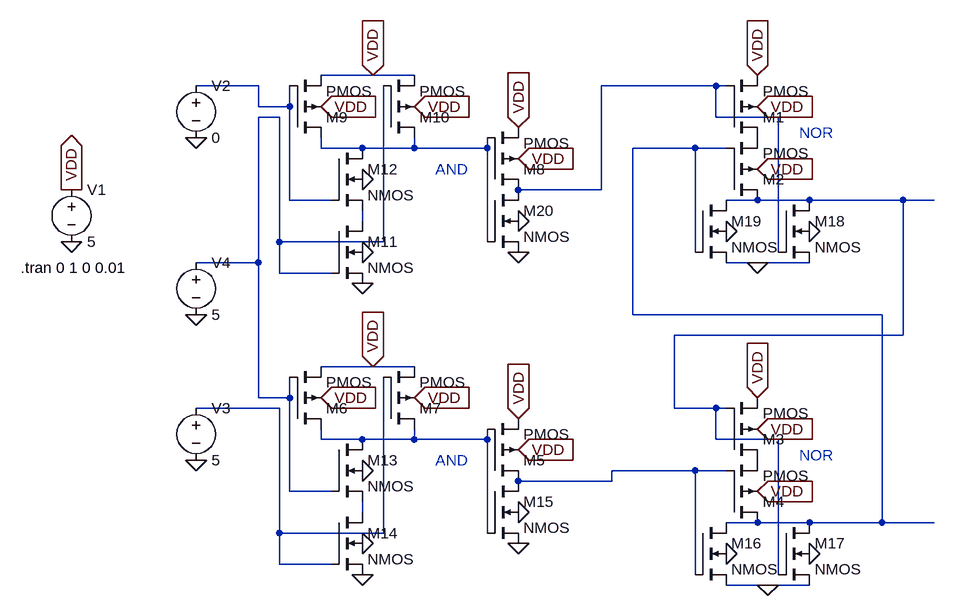
[diagram p0: schematic Gated_SR_Latch.asc]
Gated_SR_Latch.asc, the LTspice schematic file:
Version 4
SHEET 1 1076 820
WIRE 208 16 128 16
WIRE 272 16 208 16
WIRE 32 32 -64 32
WIRE 736 32 560 32
WIRE 752 32 736 32
WIRE 32 64 32 32
WIRE 80 64 80 32
WIRE 80 64 32 64
WIRE 64 80 32 80
WIRE 736 80 736 32
WIRE 832 80 736 80
WIRE 128 128 128 112
WIRE 192 128 128 128
WIRE 272 128 272 112
WIRE 272 128 192 128
WIRE 384 128 384 112
WIRE 384 128 272 128
WIRE 704 128 608 128
WIRE 752 128 704 128
WIRE 560 192 560 32
WIRE 560 192 432 192
WIRE 80 208 80 64
WIRE 144 208 80 208
WIRE 800 208 752 208
WIRE 880 208 800 208
WIRE 1024 208 880 208
WIRE 1072 208 1024 208
WIRE 192 240 192 224
WIRE 64 272 64 80
WIRE 224 272 224 32
WIRE 224 272 64 272
WIRE 384 272 384 128
WIRE 704 288 704 128
WIRE 832 288 832 80
WIRE 32 304 32 80
WIRE 32 304 -64 304
WIRE 800 304 752 304
WIRE 880 304 800 304
WIRE 64 320 64 272
WIRE 144 320 64 320
WIRE 608 384 608 128
WIRE 992 384 608 384
WIRE 1024 416 1024 208
WIRE 1024 416 672 416
WIRE 208 464 128 464
WIRE 272 464 208 464
WIRE 32 512 32 304
WIRE 80 512 80 480
WIRE 80 512 32 512
WIRE 64 528 -64 528
WIRE 672 528 672 416
WIRE 736 528 672 528
WIRE 752 528 736 528
WIRE 128 576 128 560
WIRE 192 576 128 576
WIRE 272 576 272 560
WIRE 272 576 192 576
WIRE 384 576 384 560
WIRE 384 576 272 576
WIRE 736 576 736 528
WIRE 832 576 736 576
WIRE 704 624 576 624
WIRE 752 624 704 624
WIRE 576 640 576 624
WIRE 576 640 432 640
WIRE 80 656 80 512
WIRE 144 656 80 656
WIRE 192 688 192 672
WIRE 800 704 752 704
WIRE 880 704 800 704
WIRE 992 704 992 384
WIRE 992 704 880 704
WIRE 1072 704 992 704
WIRE 64 720 64 528
WIRE 224 720 224 480
WIRE 224 720 64 720
WIRE 384 720 384 576
WIRE 64 768 64 720
WIRE 144 768 64 768
WIRE 704 784 704 624
WIRE 832 784 832 576
WIRE 816 800 752 800
WIRE 880 800 816 800
FLAG -256 192 VDD
IOPIN -256 192 Out
FLAG -256 272 0
FLAG 192 336 0
FLAG 208 16 VDD
IOPIN 208 16 In
FLAG 432 96 VDD
IOPIN 432 96 In
FLAG 432 288 0
FLAG 192 784 0
FLAG 208 464 VDD
IOPIN 208 464 In
FLAG 432 544 VDD
IOPIN 432 544 In
FLAG 432 736 0
FLAG 800 16 VDD
IOPIN 800 16 In
FLAG 800 512 VDD
IOPIN 800 512 In
FLAG 800 304 0
FLAG 816 800 0
FLAG -64 112 0
FLAG -64 608 0
FLAG -64 384 0
FLAG 192 176 0
FLAG 192 288 0
FLAG 432 240 0
FLAG 192 624 0
FLAG 192 736 0
FLAG 432 688 0
FLAG 752 752 0
FLAG 880 752 0
FLAG 880 256 0
FLAG 752 256 0
FLAG 128 64 VDD
IOPIN 128 64 In
FLAG 272 64 VDD
IOPIN 272 64 In
FLAG 432 144 VDD
IOPIN 432 144 In
FLAG 128 512 VDD
IOPIN 128 512 In
FLAG 272 512 VDD
IOPIN 272 512 In
FLAG 432 592 VDD
IOPIN 432 592 In
FLAG 800 64 VDD
IOPIN 800 64 In
FLAG 800 160 VDD
IOPIN 800 160 In
FLAG 800 560 VDD
IOPIN 800 560 In
FLAG 800 656 VDD
IOPIN 800 656 In
SYMBOL voltage -256 176 R0
WINDOW 123 0 0 Left 0
WINDOW 39 0 0 Left 0
SYMATTR InstName V1
SYMATTR Value 5
SYMBOL voltage -64 16 R0
WINDOW 123 0 0 Left 0
WINDOW 39 0 0 Left 0
SYMATTR InstName V2
SYMATTR Value 0
SYMBOL voltage -64 512 R0
WINDOW 123 0 0 Left 0
WINDOW 39 0 0 Left 0
SYMATTR InstName V3
SYMATTR Value 5
SYMBOL voltage -64 288 R0
WINDOW 123 0 0 Left 0
WINDOW 39 0 0 Left 0
SYMATTR InstName V4
SYMATTR Value 5
SYMBOL pmos4 752 112 M180
SYMATTR InstName M1
SYMBOL pmos4 752 208 M180
SYMATTR InstName M2
SYMBOL pmos4 752 608 M180
SYMATTR InstName M3
SYMBOL pmos4 752 704 M180
SYMATTR InstName M4
SYMBOL pmos4 384 640 M180
SYMATTR InstName M5
SYMBOL pmos4 80 560 M180
SYMATTR InstName M6
SYMBOL pmos4 224 560 M180
SYMATTR InstName M7
SYMBOL pmos4 384 192 M180
SYMATTR InstName M8
SYMBOL pmos4 80 112 M180
SYMATTR InstName M9
SYMBOL pmos4 224 112 M180
SYMATTR InstName M10
SYMBOL nmos4 144 240 R0
SYMATTR InstName M11
SYMBOL nmos4 144 128 R0
SYMATTR InstName M12
SYMBOL nmos4 144 576 R0
SYMATTR InstName M13
SYMBOL nmos4 144 688 R0
SYMATTR InstName M14
SYMBOL nmos4 384 640 R0
SYMATTR InstName M15
SYMBOL nmos4 704 704 R0
SYMATTR InstName M16
SYMBOL nmos4 832 704 R0
SYMATTR InstName M17
SYMBOL nmos4 832 208 R0
SYMATTR InstName M18
SYMBOL nmos4 704 208 R0
SYMATTR InstName M19
SYMBOL nmos4 384 192 R0
SYMATTR InstName M20
TEXT -334 312 Left 2 !.tran 0 1 0 0.01
TEXT 304 160 Left 2 ;AND
TEXT 304 608 Left 2 ;AND
TEXT 864 104 Left 2 ;NOR
TEXT 864 600 Left 2 ;NOR

The netlist it stands for:
* Gated_SR_Latch.asc
V1 VDD 0 5
V2 N001 0 0
V3 N008 0 5
V4 N003 0 5
M1 P001 N002 VDD VDD PMOS
M2 N006 N005 P001 VDD PMOS
M3 P002 N006 VDD VDD PMOS
M4 N005 N010 P002 VDD PMOS
M5 N010 N009 VDD VDD PMOS
M6 N009 N003 VDD VDD PMOS
M7 N009 N008 VDD VDD PMOS
M8 N002 N004 VDD VDD PMOS
M9 N004 N001 VDD VDD PMOS
M10 N004 N003 VDD VDD PMOS
M11 N007 N003 0 0 NMOS
M12 N004 N001 N007 0 NMOS
M13 N009 N003 N011 0 NMOS
M14 N011 N008 0 0 NMOS
M15 N010 N009 0 0 NMOS
M16 N005 N010 0 0 NMOS
M17 N005 N006 0 0 NMOS
M18 N006 N002 0 0 NMOS
M19 N006 N005 0 0 NMOS
M20 N002 N004 0 0 NMOS
.model NMOS NMOS
.model PMOS PMOS
.lib standard.mos
.tran 0 1 0 0.01
* AND
* AND
* NOR
* NOR
.backanno
.end